# EAGLE schematic lazurite_rev3_2 (EAGLE 7.6.0)

## Sheet 1 of 2
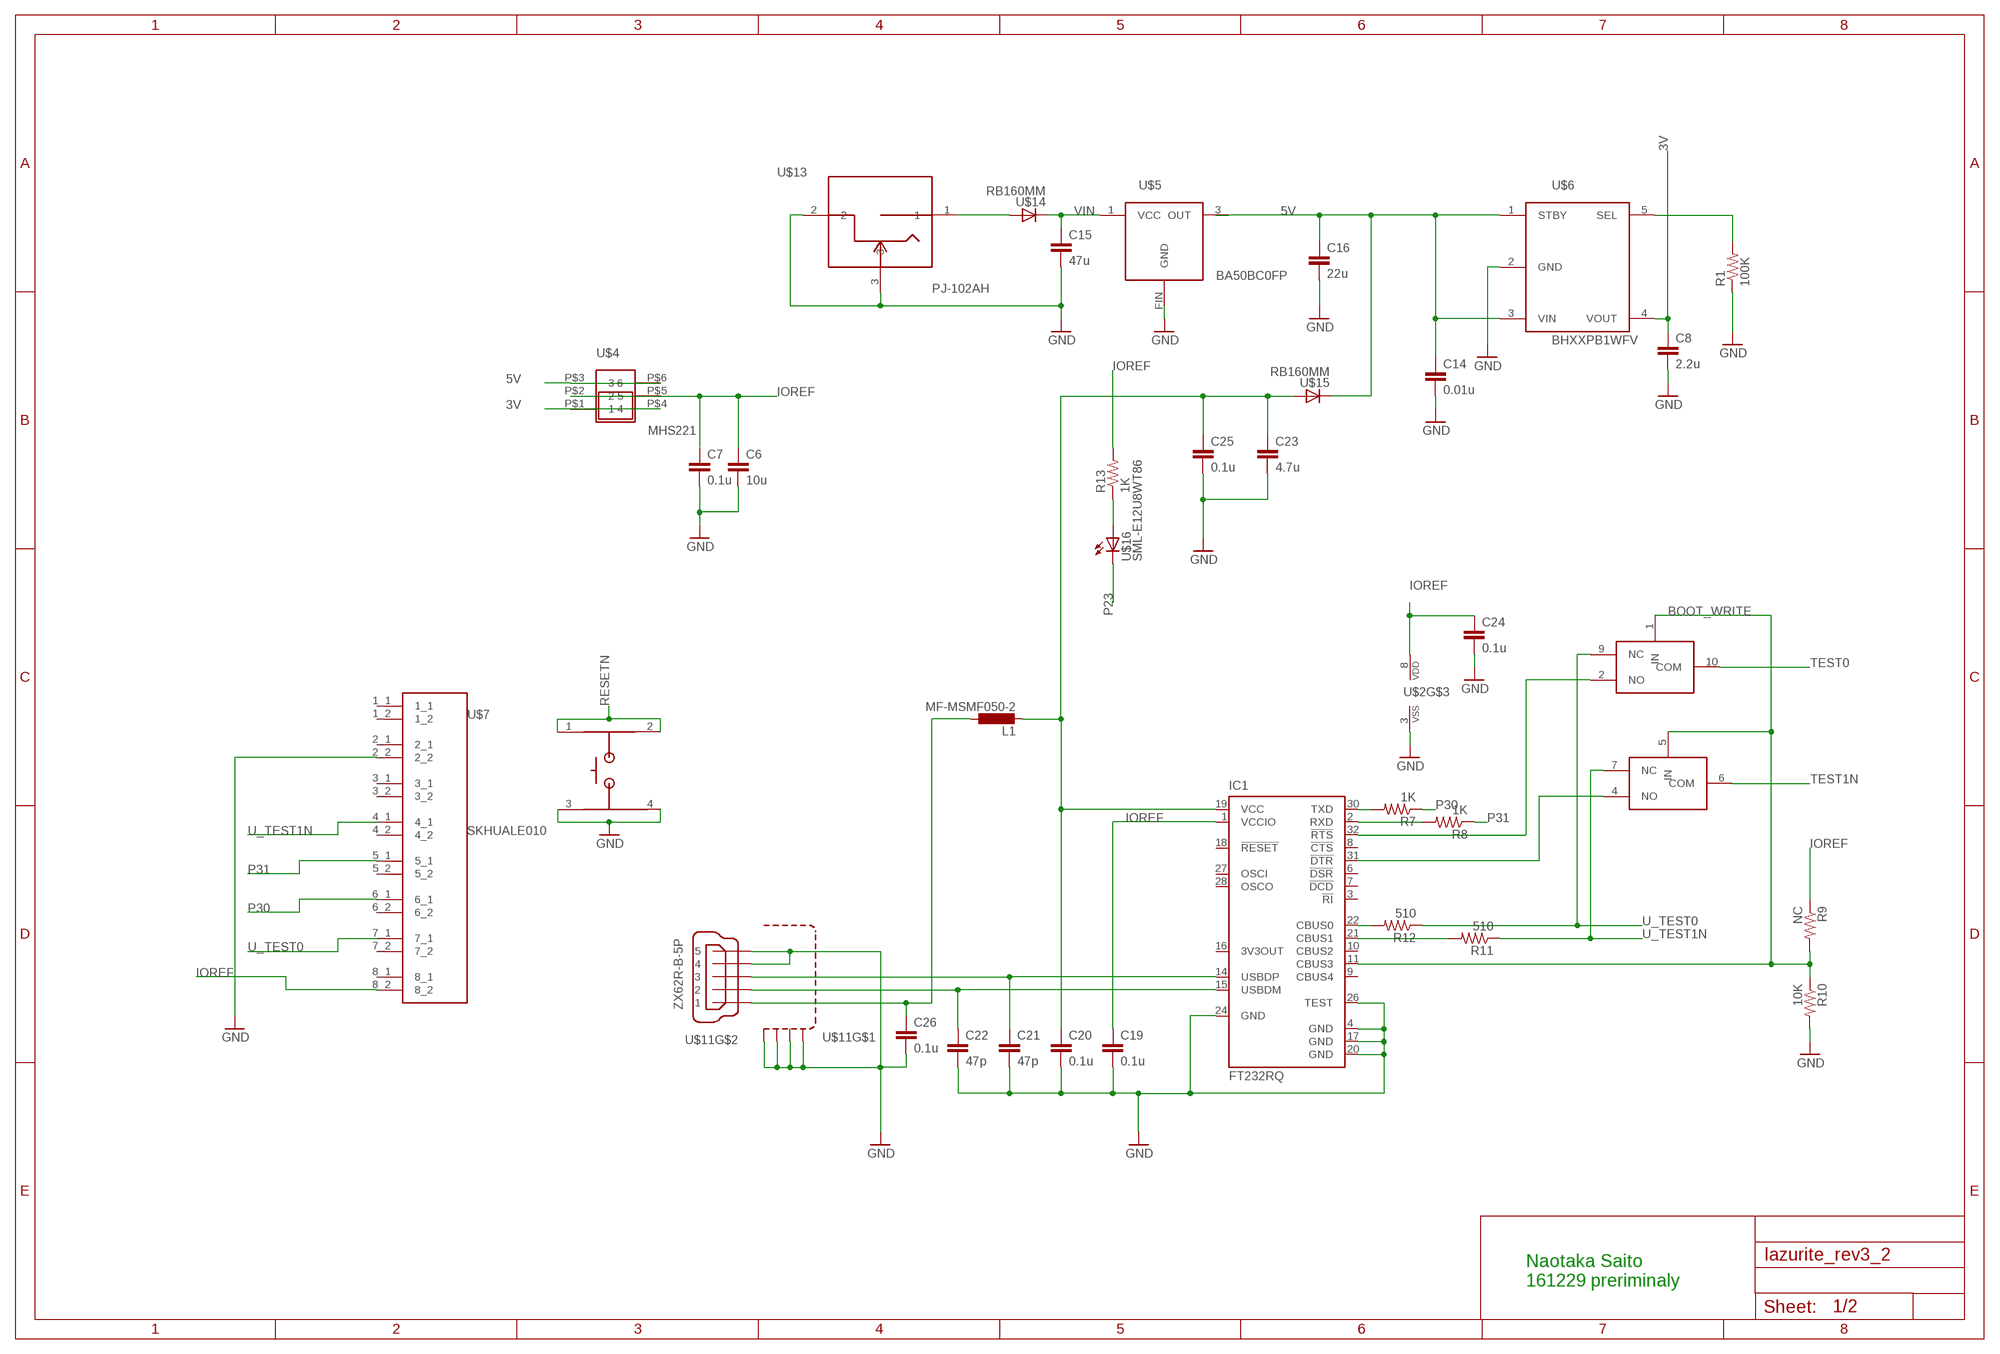
[diagram p0: schematic, sheet 1]

### Parts
C6  10u  C-EUC0402  [C0402]
C7  0.1u  C-EUC0402  [C0402]
C8  2.2u  C-EUC0402  [C0402]
C14  0.01u  C-EUC0402  [C0402]
C15  47u  C-EUC1210  [C1210]
C16  22u  C-EUC1206  [C1206]
C19  0.1u  C-EUC0402  [C0402]
C20  0.1u  C-EUC0402  [C0402]
C21  47p  C-EUC0402  [C0402]
C22  47p  C-EUC0402  [C0402]
C23  4.7u  C-EUC0402  [C0402]
C24  0.1u  C-EUC0402  [C0402]
C25  0.1u  C-EUC0402  [C0402]
C26  0.1u  C-EUC0402  [C0402]
IC1  FT232RQ  [QFN32]
L1  MF-MSMF050-2  L-EUL1812  [L1812]
R1  100K  R-US_R0402  [R0402]
R7  1K  R-US_R0402  [R0402]
R8  1K  R-US_R0402  [R0402]
R9  NC  R-US_R0402  [R0402]
R10  10K  R-US_R0402  [R0402]
R11  510  R-US_R0402  [R0402]
R12  510  R-US_R0402  [R0402]
R13  1K  R-US_R0402  [R0402]
U$2  TI-TS5A23159  [UQFN10]
U$4  MHS221  [MHS221]
U$5  BA50BC0FP  [TO252-3]
U$6  BHXXPB1WFV  [HVSOF5]
U$7  SKHUALE010  [SKHUALE010]
U$11  ZX62R-B-5P  MICRO-USB-SHIELD-ZX62R-B-5P  [ZX62R-B-5P]
U$12  XB-1-X  [XB-1-X]
U$13  PJ-102AH  [PJ-102H]
U$14  RB160MM  [RB160MM-30]
U$15  RB160MM  [RB160MM-30]
U$16  SML-E12U8WT86  SML-E1X  [SML-E1X]

### Nets
3V: C8.1 U$4.P$1 U$4.P$4 U$6.4(VOUT) ; also sheet 2
5V: C14.1 C16.1 U$4.P$3 U$4.P$6 U$5.3(OUT) U$6.1(STBY) U$6.3(VIN) U$15.C ; also sheet 2
BOOT_WRITE: IC1.11(CBUS3) R9.2 R10.1 U$2.1(IN) U$2.5(IN)
DM: C22.1 IC1.15(USBDM) U$11.2
DP: C21.1 IC1.14(USBDP) U$11.3
GND: C6.2 C7.2 C8.2 C14.2 C15.2 C16.2 C19.2 C20.2 C21.2 C22.2 C23.2 C24.2 C25.2 C26.2 IC1.4(GND) IC1.17(GND) IC1.20(GND) IC1.24(GND) IC1.26(TEST) R1.1 R10.2 U$2.3(VSS) U$5.FIN(GND) U$6.2(GND) U$7.3 U$7.4 U$11.4 U$11.5 U$11.M1(S1) U$11.M2(S2) U$11.M3(S3) U$11.M4(S4) U$12.2_2 U$13.2 U$13.3 ; also sheet 2
IOREF: C6.1 C7.1 C19.1 C24.1 IC1.1(VCCIO) R9.1 R13.2 U$2.8(VDD) U$4.P$2 U$4.P$5 U$12.8_2 ; also sheet 2
N$4: IC1.30(TXD) R7.2
N$6: IC1.22(CBUS0) R12.2
N$9: IC1.31(!DTR) U$2.4(NO)
N$10: IC1.2(RXD) R8.2
N$11: IC1.21(CBUS1) R11.2
N$16: R1.2 U$6.5(SEL)
N$17: IC1.32(!RTS) U$2.2(NO)
N$18: U$13.1 U$14.A
N$19: R13.1 U$16.A
P23: U$16.C ; also sheet 2
P30: R7.1 U$12.6_1 ; also sheet 2
P31: R8.1 U$12.5_1 ; also sheet 2
RESETN: U$7.1 U$7.2 ; also sheet 2
TEST0: U$2.10(COM) ; also sheet 2
TEST1N: U$2.6(COM) ; also sheet 2
U_TEST0: R12.1 U$2.9(NC) U$12.7_1
U_TEST1N: R11.1 U$2.7(NC) U$12.4_1
USB5V: C26.1 L1.1 U$11.1
USBVDD: C20.1 C23.1 C25.1 IC1.19(VCC) L1.2 U$15.A
VIN: C15.1 U$5.1(VCC) U$14.C ; also sheet 2
Unconnected: IC1.3(!RI) IC1.6(!DSR) IC1.7(!DCD) IC1.8(!CTS) IC1.9(CBUS4) IC1.10(CBUS2) IC1.16(3V3OUT) IC1.18(!RESET) IC1.27(OSCI) IC1.28(OSCO) U$12.1_1 U$12.1_2 U$12.2_1 U$12.3_1 U$12.3_2 U$12.4_2 U$12.5_2 U$12.6_2 U$12.7_2 U$12.8_1

### Notes on the sheet
- Naotaka Saito
  161229 preriminaly

## Sheet 2 of 2
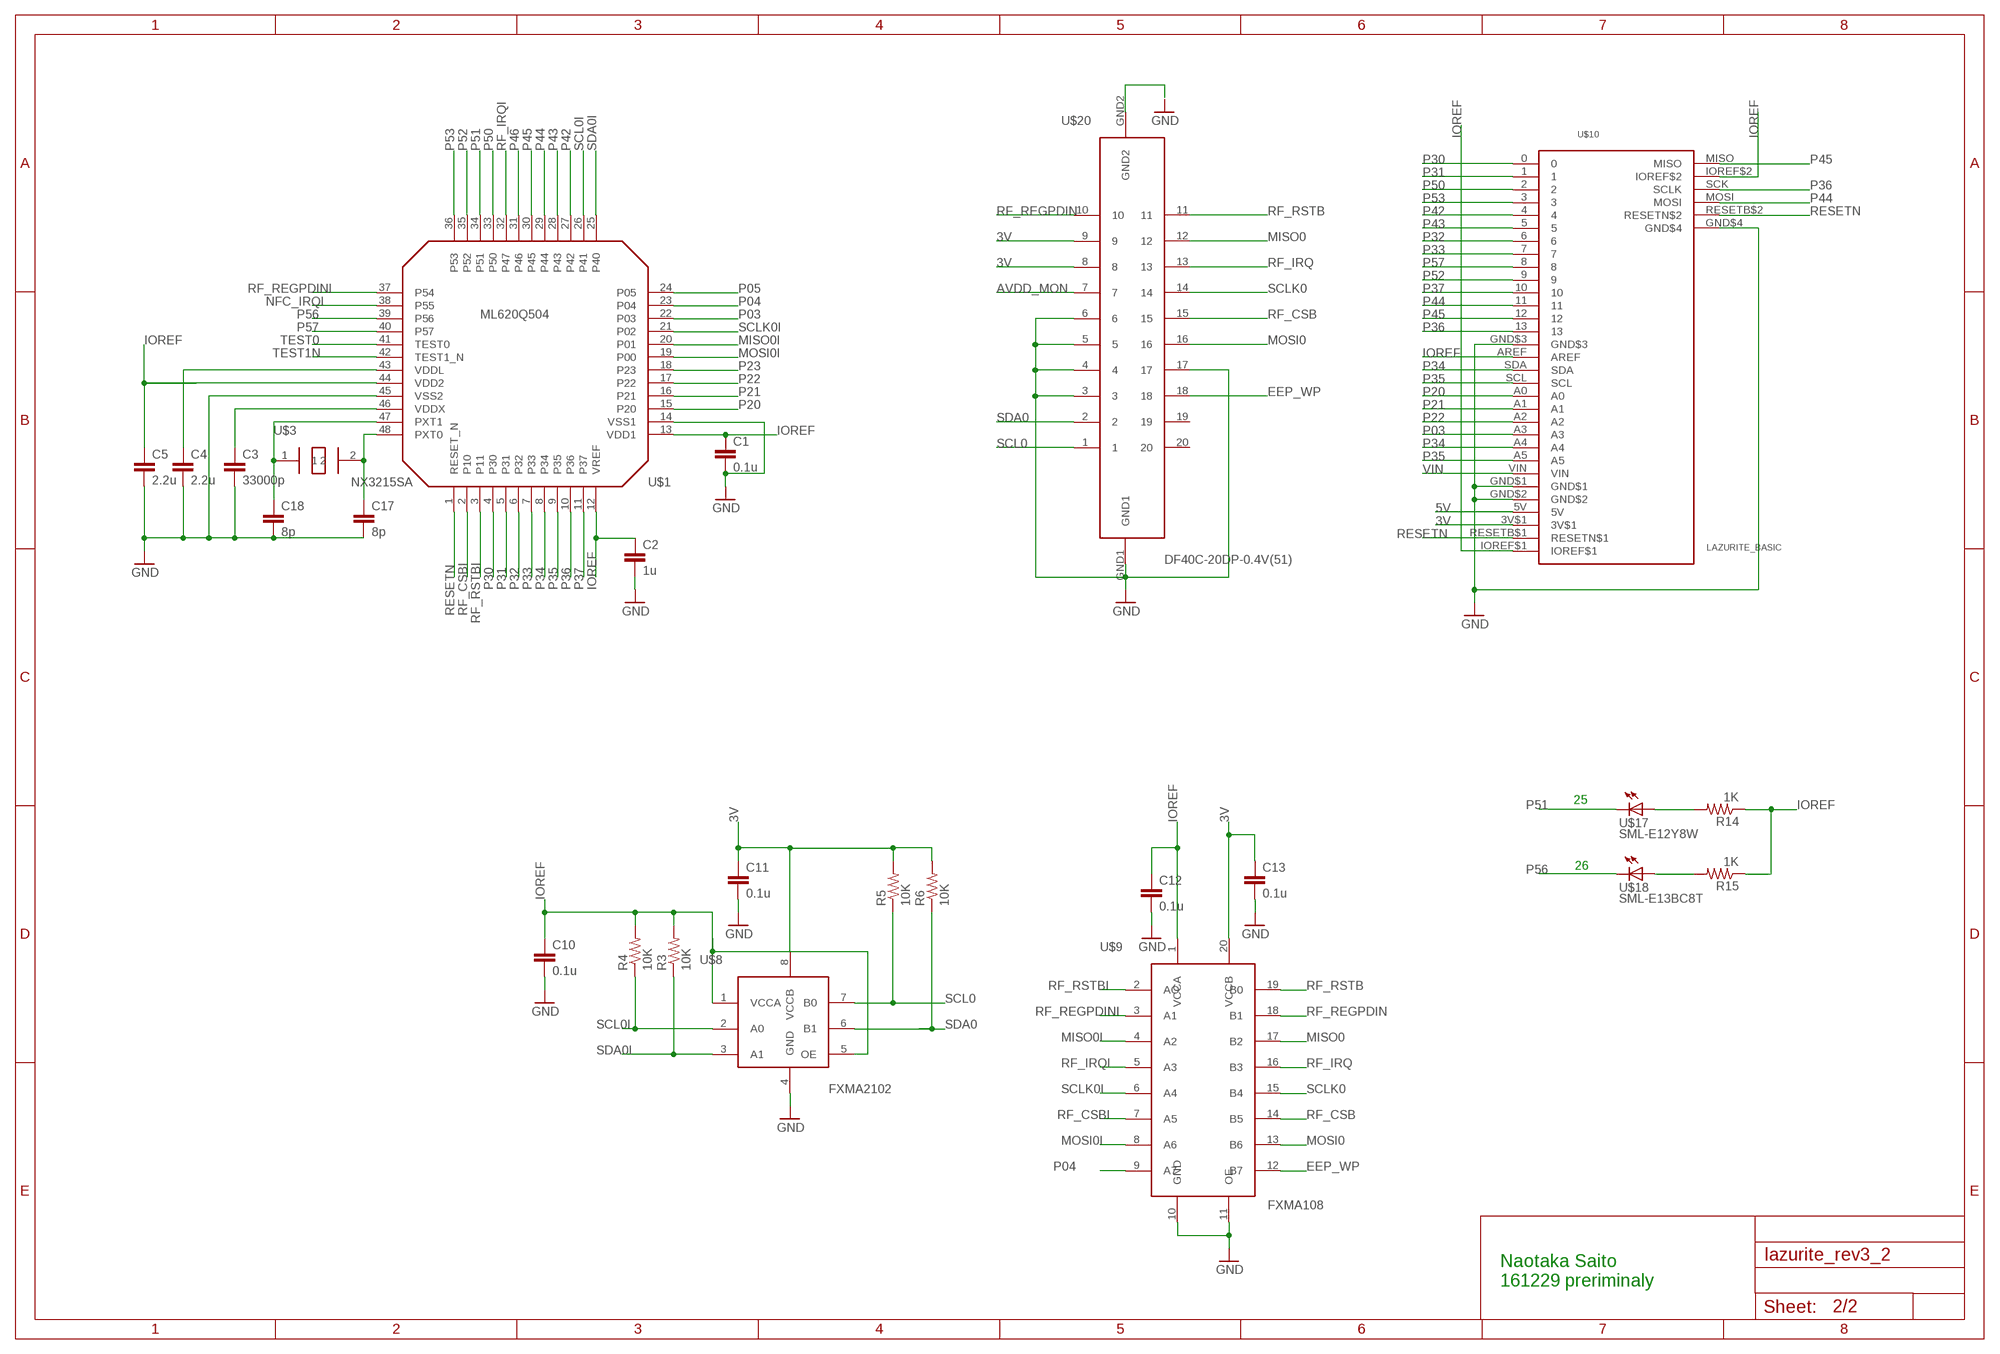
[diagram p1: schematic, sheet 2]

### Parts
C1  0.1u  C-EUC0402  [C0402]
C2  1u  C-EUC0402  [C0402]
C3  33000p  C-EUC0402  [C0402]
C4  2.2u  C-EUC0402  [C0402]
C5  2.2u  C-EUC0402  [C0402]
C10  0.1u  C-EUC0402  [C0402]
C11  0.1u  C-EUC0402  [C0402]
C12  0.1u  C-EUC0402  [C0402]
C13  0.1u  C-EUC0402  [C0402]
C17  8p  C-EUC0402  [C0402]
C18  8p  C-EUC0402  [C0402]
R3  10K  R-US_R0402  [R0402]
R4  10K  R-US_R0402  [R0402]
R5  10K  R-US_R0402  [R0402]
R6  10K  R-US_R0402  [R0402]
R14  1K  R-US_R0402  [R0402]
R15  1K  R-US_R0402  [R0402]
U$1  ML620Q504  [ML620Q504]
U$3  NX3215SA  [NX3215SA-32,768K-SFD-MUA-14]
U$8  FXMA2102  [MICROPACK]
U$9  FXMA108  [FXMA108]
U$10  LAZURITE_BASIC  [LAZURITE_BASIC]
U$17  SML-E12Y8W  SML-E1X  [SML-E1X]
U$18  SML-E13BC8T  SML-E1X  [SML-E1X]
U$20  DF40C-20DP-0.4V(51)  BP3596A  [BP3596A]

### Nets
3V: C11.1 C13.1 R5.2 R6.2 U$8.8(VCCB) U$9.20(VCCB) U$10.3V$1 U$20.8 U$20.9 ; also sheet 1
5V: U$10.5V ; also sheet 1
AVDD_MON: U$20.7
EEP_WP: U$9.12(B7) U$20.18
GND: C1.2 C2.2 C3.2 C4.2 C5.2 C10.2 C11.2 C12.2 C13.2 C17.2 C18.2 U$1.14(VSS1) U$1.45(VSS2) U$8.4(GND) U$9.10(GND) U$9.11(OE) U$10.GND$1 U$10.GND$2 U$10.GND$3 U$10.GND$4 U$20.3 U$20.4 U$20.5 U$20.6 U$20.17 U$20.GND1 ; also sheet 1
IOREF: C1.1 C2.1 C5.1 C10.1 C12.1 R3.2 R4.2 R14.1 R15.1 U$1.12(VREF) U$1.13(VDD1) U$1.44(VDD2) U$8.1(VCCA) U$8.5(OE) U$9.1(VCCA) U$10.AREF U$10.IOREF$1 U$10.IOREF$2 ; also sheet 1
MISO0: U$9.17(B2) U$20.12
MISO0I: U$1.20(P01) U$9.4(A2)
MOSI0: U$9.13(B6) U$20.16
MOSI0I: U$1.19(P00) U$9.8(A6)
N$1: C17.1 U$1.48(PXT0) U$3.2
N$2: C18.1 U$1.47(PXT1) U$3.1
N$3: C3.1 U$1.46(VDDX)
N$5: R14.2 U$17.A
N$7: C4.1 U$1.43(VDDL)
N$22: R15.2 U$18.A
N$24: U$20.GND2
NFC_IRQI: U$1.38(P55)
P03: U$1.22(P03) U$10.A3
P04: U$1.23(P04) U$9.9(A7)
P05: U$1.24(P05)
P20: U$1.15(P20) U$10.A0
P21: U$1.16(P21) U$10.A1
P22: U$1.17(P22) U$10.A2
P23: U$1.18(P23) ; also sheet 1
P30: U$1.4(P30) U$10.0 ; also sheet 1
P31: U$1.5(P31) U$10.1 ; also sheet 1
P32: U$1.6(P32) U$10.6
P33: U$1.7(P33) U$10.7
P34: U$1.8(P34) U$10.A4 U$10.SDA
P35: U$1.9(P35) U$10.A5 U$10.SCL
P36: U$1.10(P36) U$10.13 U$10.SCK(SCLK)
P37: U$1.11(P37) U$10.10
P42: U$1.27(P42) U$10.4
P43: U$1.28(P43) U$10.5
P44: U$1.29(P44) U$10.11 U$10.MOSI
P45: U$1.30(P45) U$10.12 U$10.MISO
P46: U$1.31(P46)
P50: U$1.33(P50) U$10.2
P51: U$1.34(P51) U$17.C
P52: U$1.35(P52) U$10.9
P53: U$1.36(P53) U$10.3
P56: U$1.39(P56) U$18.C
P57: U$1.40(P57) U$10.8
RESETN: U$1.1(RESET_N) U$10.RESETB$1(RESETN$1) U$10.RESETB$2(RESETN$2) ; also sheet 1
RF_CSB: U$9.14(B5) U$20.15
RF_CSBI: U$1.2(P10) U$9.7(A5)
RF_IRQ: U$9.16(B3) U$20.13
RF_IRQI: U$1.32(P47) U$9.5(A3)
RF_REGPDIN: U$9.18(B1) U$20.10
RF_REGPDINI: U$1.37(P54) U$9.3(A1)
RF_RSTB: U$9.19(B0) U$20.11
RF_RSTBI: U$1.3(P11) U$9.2(AO)
SCL0: R5.1 U$8.7(B0) U$20.1
SCL0I: R4.1 U$1.26(P41) U$8.2(A0)
SCLK0: U$9.15(B4) U$20.14
SCLK0I: U$1.21(P02) U$9.6(A4)
SDA0: R6.1 U$8.6(B1) U$20.2
SDA0I: R3.1 U$1.25(P40) U$8.3(A1)
TEST0: U$1.41(TEST0) ; also sheet 1
TEST1N: U$1.42(TEST1_N) ; also sheet 1
VIN: U$10.VIN ; also sheet 1
Unconnected: U$20.19 U$20.20

### Notes on the sheet
- 25
- 26
- Naotaka Saito
  161229 preriminaly

## Library data of the parts
C1-C8 C10-C26 = rcl:C-EU: CAPACITOR, European symbol
IC1 = ftdichip:FT232R: Source: http://www.ftdichip.com/Documents/DataSheets/DS_FT232R_v104.pdf; MPN: FT232RQ; OC_FARNELL: 1146033; OC_NEWARK: 91K9919
L1 = rcl:L-EU: INDUCTOR, European symbol
R1 R3-R15 = rcl:R-US_: RESISTOR, American symbol
U$1 = lazurite:ML620Q504
U$2 = lz-shield:TI-TS5A23159
U$3 = lazurite:NX3215SA
U$4 = lazurite:MHS221
U$5 = lazurite:BA50BC0FP
U$6 = lazurite:BHXXPB1WFV
U$7 = lazurite:SKHUALE010
U$8 = lazurite:FXMA2102
U$9 = lazurite:FXMA108
U$10 = lazurite:LAZURITE_BASIC
U$11 = con-hirose:MICRO-USB-SHIELD-: Hirose Micro USB Connector ZX62R-B-5P: Micro B, reverse (top mount) shell SMT Supplier: DigiKey H11574CT-ND Source: http://www.hirose.co.jp/cataloge_hp/e24200011.pdf
U$12 = lz-shield:XB-1-X
U$13 = lazurite:PJ-102AH
U$14 U$15 = lazurite:RB160MM
U$16-U$18 = lazurite:SML-E1X
U$20 = lazurite:BP3596A